# Altium schematic sheet Camera.SchDoc
size A; SheetNumber: 16; SheetTotal: 15
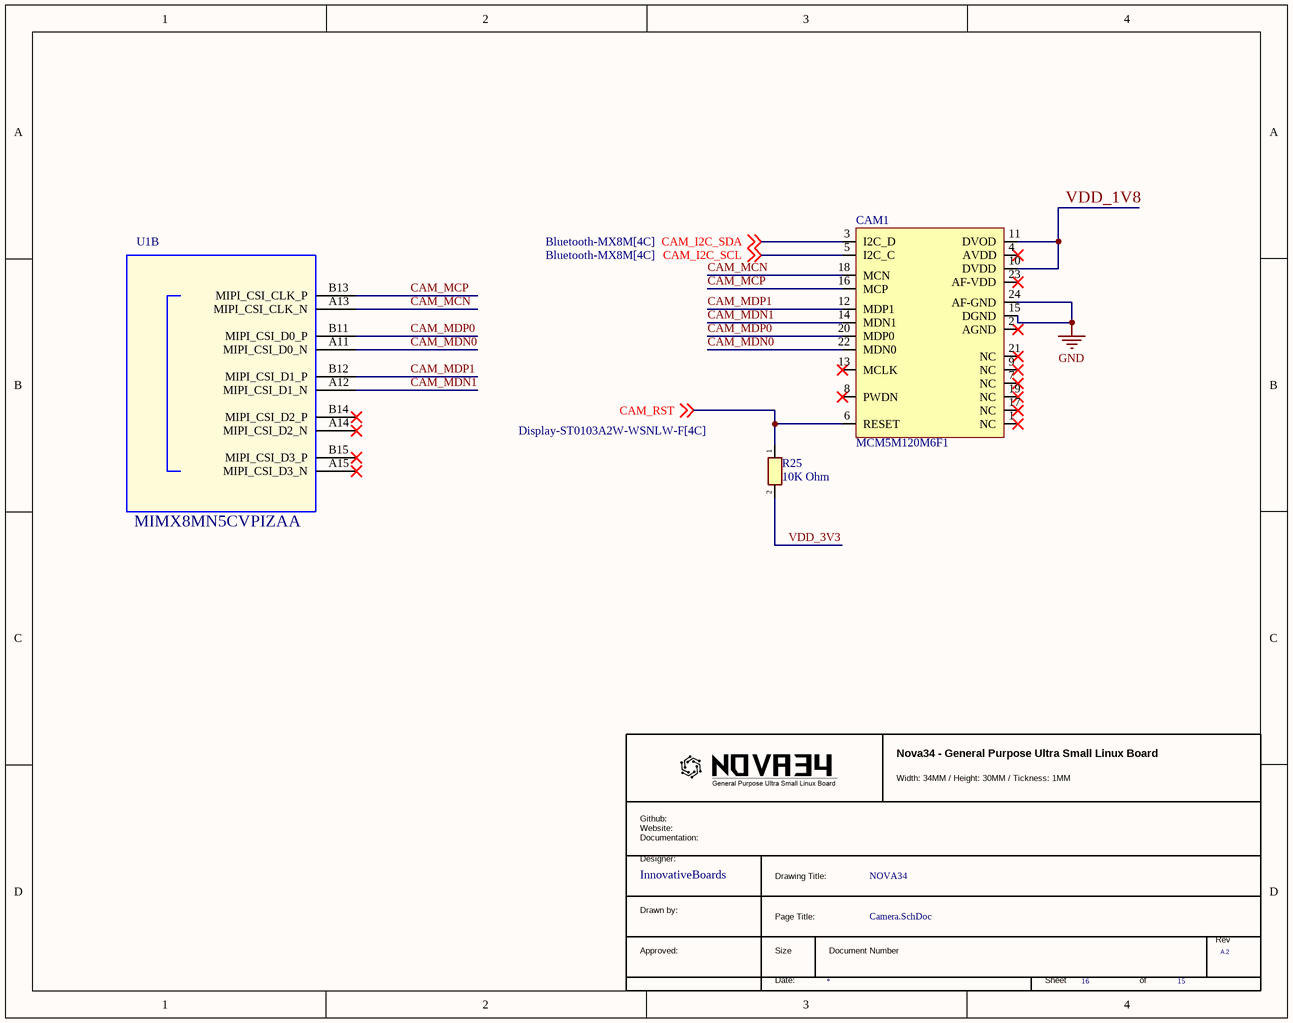
[diagram p0: Camera.SchDoc]

## Parts
*  RevCode: A.2  (hidden comment: TitleBlock_MCPG)  (graphical)
CAM1  MCM5M120M6F1  [MCM5M120M6F1]
R25  10K Ohm  [RESC1005X40N]
U1  MIMX8MN5CVPIZAA  [BGA306C50P21X21_1100X1100X101]  (part B of 12)

## Nets
GND: CAM1.15(DGND) CAM1.24(AF-GND)
CAM_I2C_SCL: CAM1.5(I2C_C) ; off-sheet CAM_I2C_SCL
CAM_I2C_SDA: CAM1.3(I2C_D) ; off-sheet CAM_I2C_SDA
CAM_MCN: CAM1.18(MCN) U1.A13(MIPI_CSI_CLK_N)
CAM_MCP: CAM1.16(MCP) U1.B13(MIPI_CSI_CLK_P)
CAM_MDN0: CAM1.22(MDN0) U1.A11(MIPI_CSI_D0_N)
CAM_MDN1: CAM1.14(MDN1) U1.A12(MIPI_CSI_D1_N)
CAM_MDP0: CAM1.20(MDP0) U1.B11(MIPI_CSI_D0_P)
CAM_MDP1: CAM1.12(MDP1) U1.B12(MIPI_CSI_D1_P)
CAM_RST: CAM1.6(RESET) R25.1 ; off-sheet CAM_RST
VDD_1V8: CAM1.10(DVDD) CAM1.11(DVOD)
VDD_3V3: R25.2

Not connected (* = marked no-connect by the designer): CAM1 1(NC)* 2(AGND)* 4(AVDD)* 7(NC)* 8(PWDN)* 9(NC)* 13(MCLK)* 17(NC)* 19(NC)* 21(NC)* 23(AF-VDD)*; U1 A14(MIPI_CSI_D2_N)* A15(MIPI_CSI_D3_N)* B14(MIPI_CSI_D2_P)* B15(MIPI_CSI_D3_P)*

## Notes on the sheet
- (in symbol TitleBlock_MCPG) Nova34 - General Purpose Ultra Small Linux Board; Width: 34MM / Height: 30MM / Tickness: 1MM; Github: / Website: / Documentation:; Designer:; InnovativeBoards; Drawing Title:; NOVA34; Drawn by:; Page Title:; Rev; Approved:; Size; Document Number; Date:; Sheet; of

## Library data of the parts
CAM1 = MCM5M120M6F1: MCM5M120M6F1 is a cost effective 5 Mega Pixel MIPI camera module with an M6 lens slot.; ComponentLink1Description: New link; ComponentLink1URL: https://iadiy.com/MIPI-CAMERA-MODULE?product_id=641
R25 = RC0402FR-0710KL: Resistor; Manufacturer_Name: KEMET; Datasheet Link: http://www.yageo.com/documents/recent/PYu-RC0402_51_RoHS_L_6_r.pdf; Height: 0.4mm; Manufacturer_Part_Number: RC0402FR-0710KL; Mouser Part Number: 603-RC0402FR-0710KL; Mouser Price/Stock: https://www.mouser.co.uk/ProductDetail/YAGEO/RC0402FR-0710KL?qs=I1mnnYJTTsxUoNwrUsQExA%3D%3D; Arrow Part Number: RC0402FR-0710KL; Arrow Price/Stock: https://www.arrow.com/en/products/rc0402fr-0710kl/yageo?region=europe
U1 = MIMX8MN: IC CPU QUAD CORTEX A53+M7 1.4GHZ -- BGA306; PCB Footprint: pbga306_0p5_sq11mm; AGILE_PN: TMP-CIP-5098; CAD_APPROVED: Yes; PRE_APN: 330-77152; Temp Range: -40¡ãC to 105¡ãC; MFG_NAME01: NXP SEMICONDUCTORS; CLASS: IC; HEIGHT: 1.01MM; ROHS: Yes; MFG_PN01: MIMX8MN5CVPIZAA
* = TitleBlock_MCPG: Page Create Date: March  8, 1995